# Altium schematic sheet TMC2130.SchDoc
size A
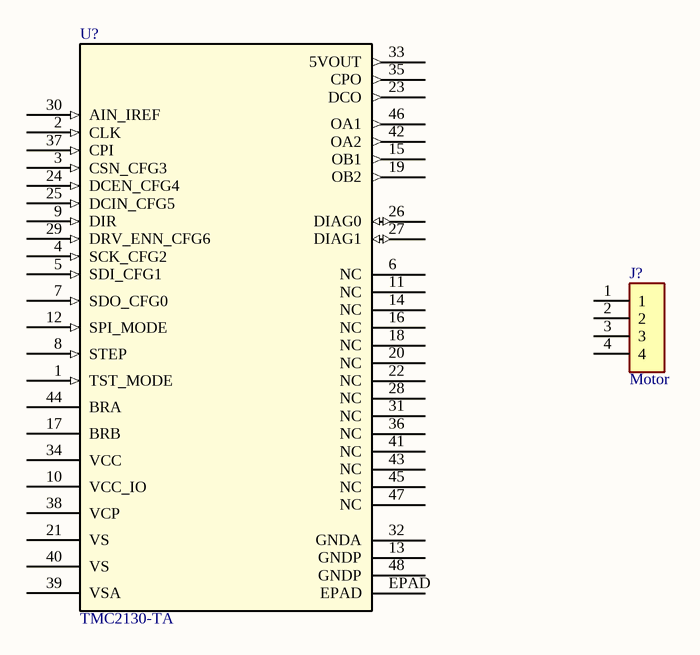
[diagram p0: TMC2130.SchDoc]

## Parts
J?  Motor  [SHDR4W64P0X250_1X4_1240X1155X700P]
U?  TMC2130-TA  [eTQFP48_9x9]

## Nets

Not connected (* = marked no-connect by the designer): J? 1 2 3 4; U? 1(TST_MODE) 2(CLK) 3(CSN_CFG3) 4(SCK_CFG2) 5(SDI_CFG1) 6(NC) 7(SDO_CFG0) 8(STEP) 9(DIR) 10(VCC_IO) 11(NC) 12(SPI_MODE) 13(GNDP) 14(NC) 15(OB1) 16(NC) 17(BRB) 18(NC) 19(OB2) 20(NC) 21(VS) 22(NC) 23(DCO) 24(DCEN_CFG4) 25(DCIN_CFG5) 26(DIAG0) 27(DIAG1) 28(NC) 29(DRV_ENN_CFG6) 30(AIN_IREF) 31(NC) 32(GNDA) 33(5VOUT) 34(VCC) 35(CPO) 36(NC) 37(CPI) 38(VCP) 39(VSA) 40(VS) 41(NC) 42(OA2) 43(NC) 44(BRA) 45(NC) 46(OA1) 47(NC) 48(GNDP) EPAD

## Library data of the parts
J? = JST 4POS: Connector; Manufacturer_Name: JST (JAPAN SOLDERLESS TERMINALS); Manufacturer_Part_Number: S4B-XH-A(LF)(SN); Datasheet Link: http://www.jst-mfg.com/product/pdf/eng/eXH.pdf; Height: 7mm; RS Part Number: 8201589P; RS Price/Stock: http://uk.rs-online.com/web/p/products/8201589P
U? = TMC2130-TA: Motor Driver TMC2130; Built_By: EMA_Jessica; Vendor: TRINAMIC; Copyright: Copyright (C) 2016 Accelerated Designs. All rights reserved; Manufacturer_Part_Number: TMC2130-TA; RefDes: RefDes; Type: DEV; Value: Value